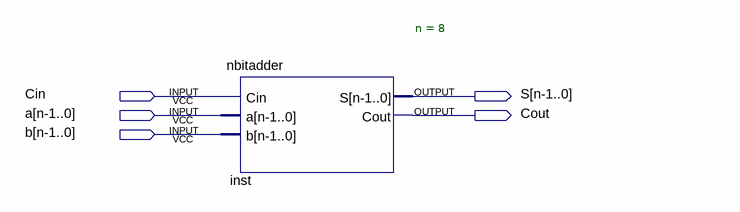
[diagram p0: schematic sheet]
// Quartus schematic nbitadder.bdf as structural Verilog: 1 symbols, 5 pins
module nbitadder (
  input  Cin,
  input  \a[n-1..0] ,
  input  \b[n-1..0] ,
  output \S[n-1..0] ,
  output Cout
);

  nbitadder #(.n(8)) inst (.Cin(Cin), .a({8{\a[n-1..0] }}), .b({8{\b[n-1..0] }}), .S(\S[n-1..0] ), .Cout(Cout));
endmodule
